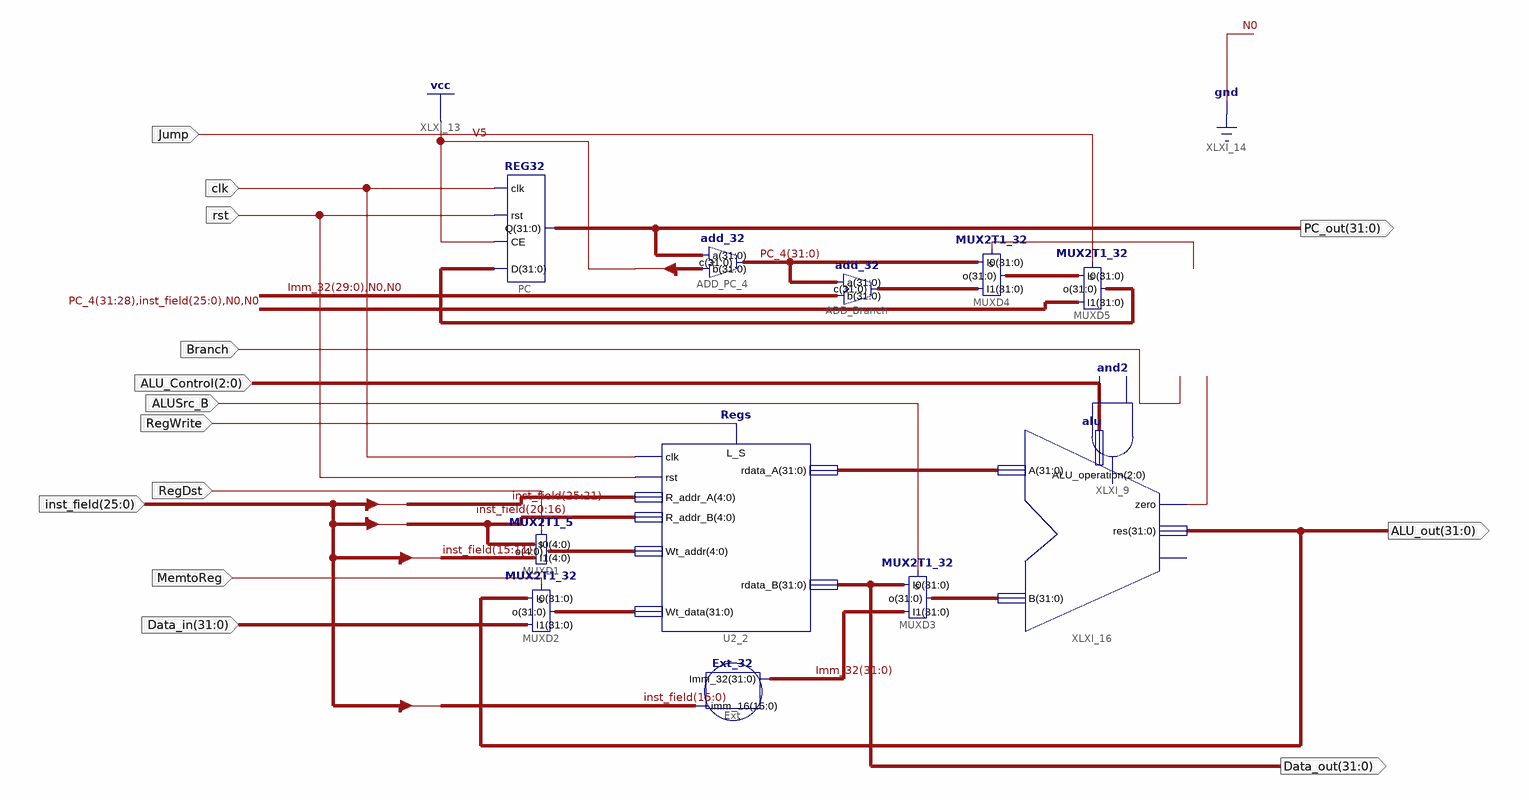
[diagram p0: schematic sheet 1]
// Xilinx ISE schematic Data_path.sch (kintex7) as structural Verilog: 12 symbols, 14 ports
module Data_path (
  input  Jump,
  input  clk,
  input  rst,
  input  [2:0] ALU_Control,
  input  Branch,
  input  ALUSrc_B,
  input  RegWrite,
  input  [31:0] Data_in,
  input  MemtoReg,
  input  RegDst,
  input  [25:0] inst_field,
  output [31:0] PC_out,
  output [31:0] Data_out,
  output [31:0] ALU_out
);

  wire XLXN_8, XLXN_12;
  wire [4:0] XLXN_38;
  wire [31:0] Imm_32, PC_4, XLXN_5, XLXN_6, XLXN_18, XLXN_22, XLXN_24, XLXN_37;

  REG32 PC (.D(XLXN_18), .CE(1'b1), .rst(rst), .clk(clk), .Q(PC_out));
  Regs U2_2 (
    .clk(clk), .L_S(RegWrite), .rdata_A(XLXN_22), .rst(rst), .Wt_data(XLXN_37), .rdata_B(Data_out),
    .R_addr_A(inst_field[25:21]), .R_addr_B(inst_field[20:16]), .Wt_addr(XLXN_38));
  Ext_32 Ext (.imm_16(inst_field[15:0]), .Imm_32(Imm_32));
  add_32 ADD_PC_4 (.c(PC_4), .a(PC_out), .b(32'b00000000000000000000000000000100));
  add_32 ADD_Branch (.c(XLXN_5), .a(PC_4), .b({Imm_32[29:0], 2'b00}));
  MUX2T1_32 MUXD4 (.s(XLXN_8), .I0(PC_4), .I1(XLXN_5), .o(XLXN_6));
  MUX2T1_32 MUXD5 (.s(Jump), .I0(XLXN_6), .I1({PC_4[31:28], inst_field, 2'b00}), .o(XLXN_18));
  and XLXI_9 (XLXN_8, Branch, XLXN_12);
  MUX2T1_32 MUXD3 (.s(ALUSrc_B), .I0(Data_out), .I1(Imm_32), .o(XLXN_24));
  MUX2T1_32 MUXD2 (.s(MemtoReg), .I0(ALU_out), .I1(Data_in), .o(XLXN_37));
  MUX2T1_5 MUXD1 (.I1(inst_field[15:11]), .I0(inst_field[20:16]), .o(XLXN_38), .s(RegDst));
  alu XLXI_16 (.zero(XLXN_12), .res(ALU_out), .A(XLXN_22), .B(XLXN_24), .ALU_operation(ALU_Control));  // open: overflow
endmodule
